# EAGLE design board (EAGLE 9.4.2)
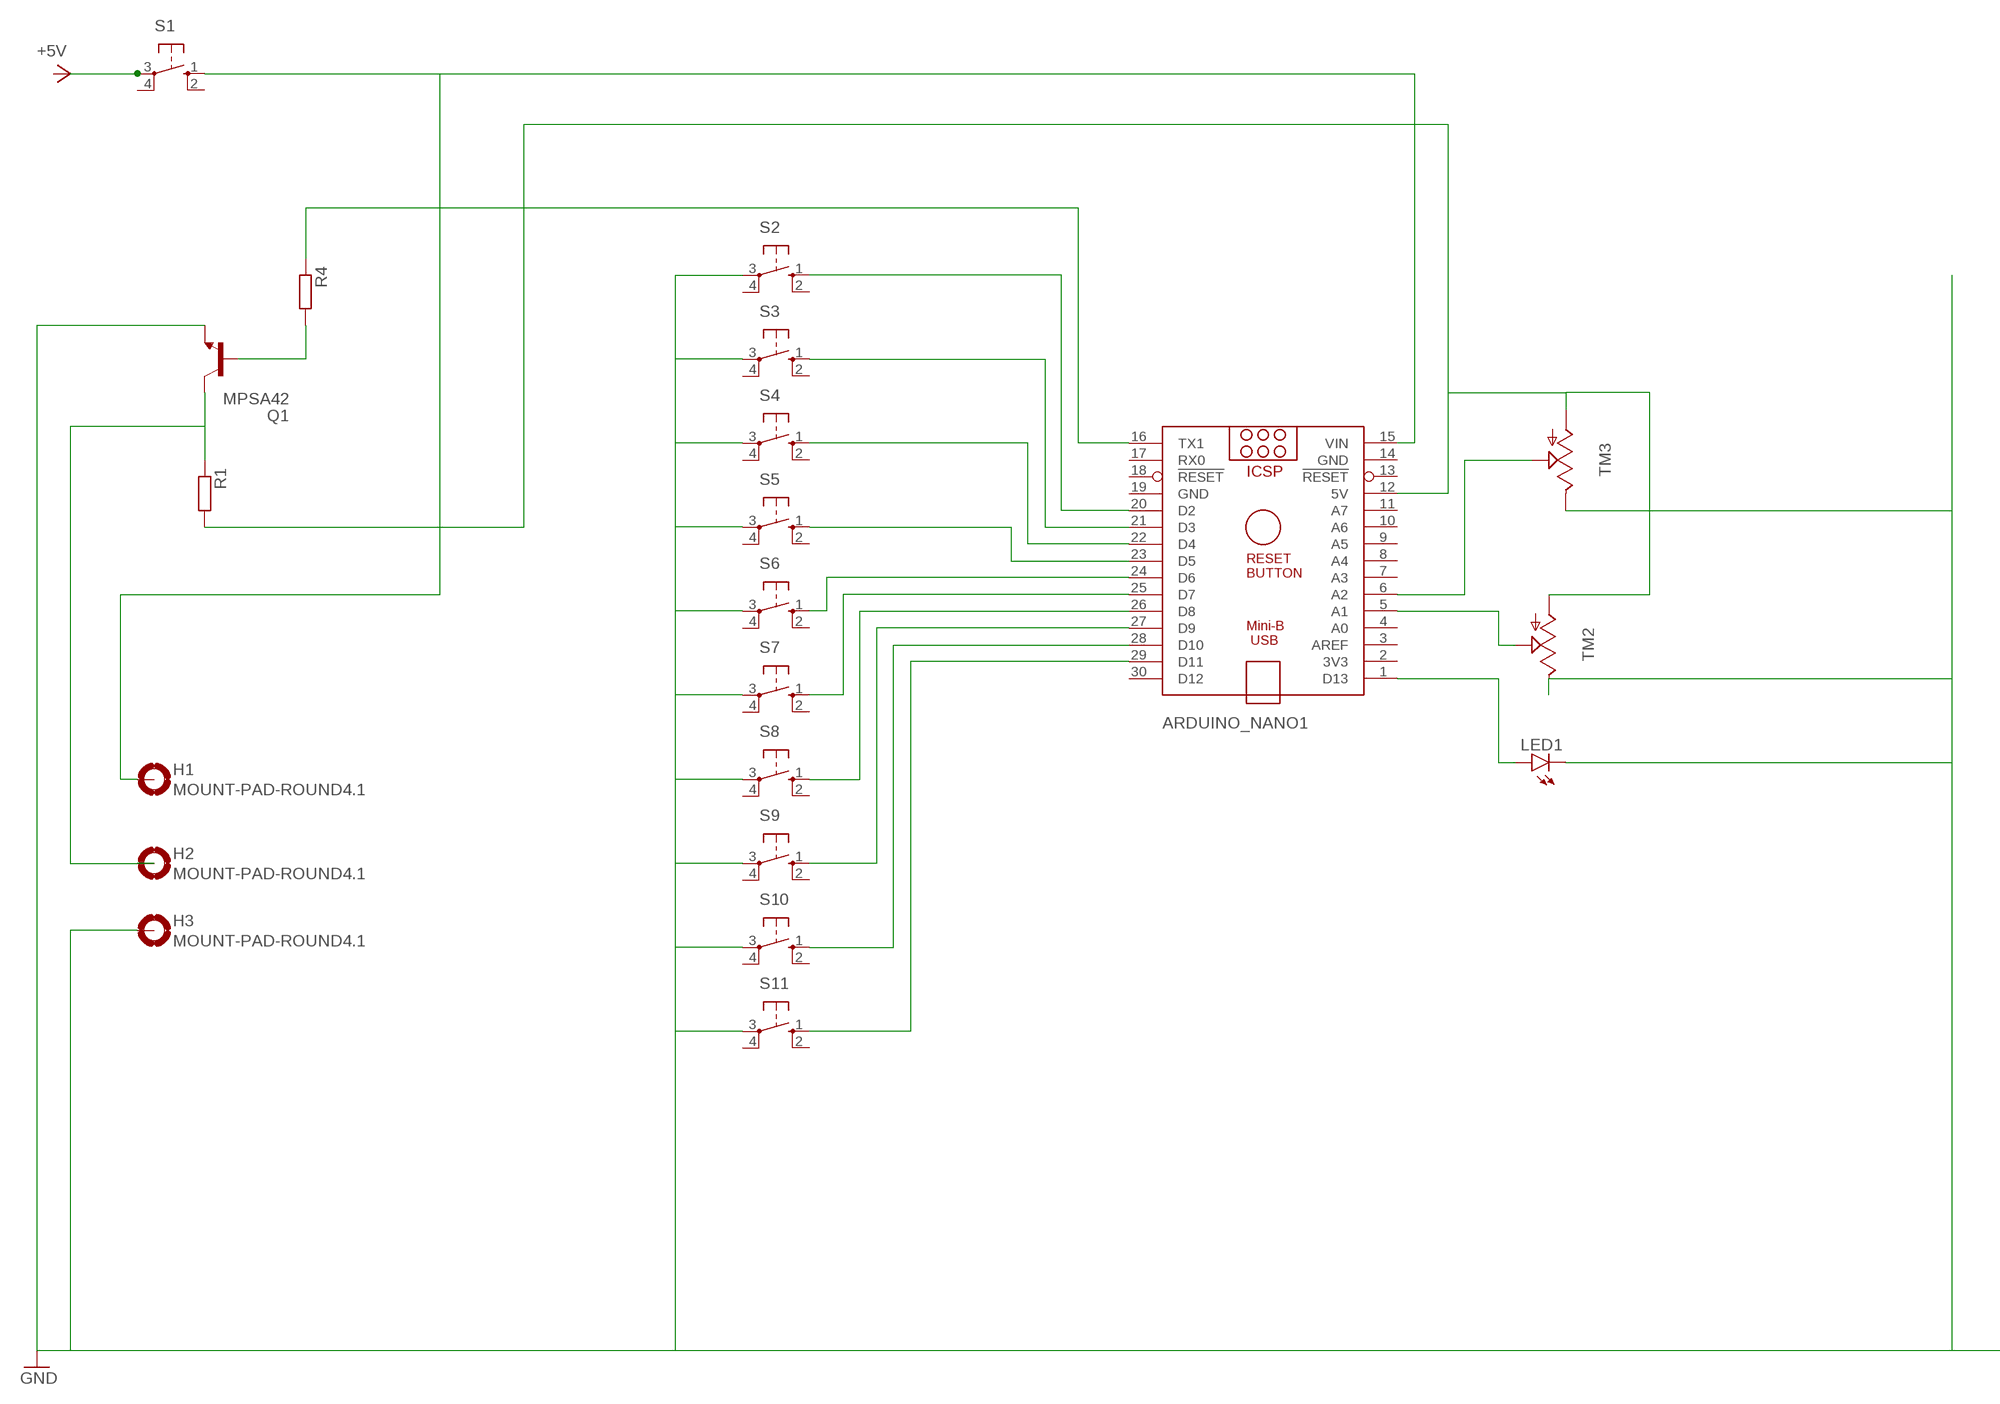
[diagram p0: schematic, sheet 1]

## Parts
ARDUINO_NANO1  ARDUINO_NANO  [ARDUINO_NANO]
H1  MOUNT-PAD-ROUND4.1  [4,1-PAD]
H2  MOUNT-PAD-ROUND4.1  [4,1-PAD]
H3  MOUNT-PAD-ROUND4.1  [4,1-PAD]
LED1  LED5MM  [LED5MM]
Q1  MPSA42  [TO92]
R1  R-EU_0204/2V  [0204V]
R4  R-EU_0204/2V  [0204V]
S1  40-XX  [B3F-40XX]
S2  10-XX  [B3F-10XX]
S3  10-XX  [B3F-10XX]
S4  10-XX  [B3F-10XX]
S5  10-XX  [B3F-10XX]
S6  10-XX  [B3F-10XX]
S7  10-XX  [B3F-10XX]
S8  10-XX  [B3F-10XX]
S9  10-XX  [B3F-10XX]
S10  10-XX  [B3F-10XX]
S11  10-XX  [B3F-10XX]
TM2  TRIMSLIDE75  [SLIDEPOT-75]
TM3  TRIMSLIDE75  [SLIDEPOT-75]

## Nets
GND: H3.B4,1(MOUNT) LED1.K(C) Q1.3(E) S2.3(P) S3.3(P) S4.3(P) S5.3(P) S6.3(P) S7.3(P) S8.3(P) S9.3(P) S10.3(P) S11.3(P) TM2.B TM3.B
N$1: S1.3(P)
N$2: ARDUINO_NANO1.12(5V) R1.2 TM2.A TM3.A
N$3: ARDUINO_NANO1.20(D2) S2.1(S)
N$4: ARDUINO_NANO1.21(D3) S3.1(S)
N$5: ARDUINO_NANO1.22(D4) S4.1(S)
N$6: ARDUINO_NANO1.23(D5) S5.1(S)
N$7: ARDUINO_NANO1.24(D6) S6.1(S)
N$8: ARDUINO_NANO1.25(D7) S7.1(S)
N$9: ARDUINO_NANO1.26(D8) S8.1(S)
N$10: ARDUINO_NANO1.27(D9) S9.1(S)
N$11: ARDUINO_NANO1.28(D10) S10.1(S)
N$12: ARDUINO_NANO1.29(D11) S11.1(S)
N$13: ARDUINO_NANO1.15(VIN) H1.B4,1(MOUNT) S1.1(S)
N$14: ARDUINO_NANO1.16(TX1) R4.1
N$15: Q1.2(B) R4.2
N$16: ARDUINO_NANO1.6(A2) TM3.WIPER
N$17: ARDUINO_NANO1.5(A1) TM2.WIPER
N$18: H2.B4,1(MOUNT) Q1.1(C) R1.1
N$19: ARDUINO_NANO1.1(D13) LED1.A
Unconnected: ARDUINO_NANO1.2(3V3) ARDUINO_NANO1.3(AREF) ARDUINO_NANO1.4(A0) ARDUINO_NANO1.7(A3) ARDUINO_NANO1.8(A4) ARDUINO_NANO1.9(A5) ARDUINO_NANO1.10(A6) ARDUINO_NANO1.11(A7) ARDUINO_NANO1.13(!RESET) ARDUINO_NANO1.17(RX0) ARDUINO_NANO1.18(!RESET) ARDUINO_NANO1.30(D12) S1.2(S1) S1.4(P1) S2.2(S1) S2.4(P1) S3.2(S1) S3.4(P1) S4.2(S1) S4.4(P1) S5.2(S1) S5.4(P1) S6.2(S1) S6.4(P1) S7.2(S1) S7.4(P1) S8.2(S1) S8.4(P1) S9.2(S1) S9.4(P1) S10.2(S1) S10.4(P1) S11.2(S1) S11.4(P1)

## Power pins joined to a net without a drawn wire
GND: ARDUINO_NANO1.14(GND) ARDUINO_NANO1.19(GND)

## Library data of the parts
ARDUINO_NANO1 = ArduinoNanoV30:ARDUINO_NANO: Arduino Nano V3.0 Overview: The Arduino Nano is a small, complete, and breadboard-friendly board based on the ATmega328 (Arduino Nano 3.x) or ATmega168 (Arduino Nano 2.x). It has more or less the same functionality of the Arduino Duemilanove, but in a different package. It lacks only a DC power jack, and works with a Mini-B USB cable instead of a standard one. The Nano was designed and is being produced by Gravitech. Specifications: Microcontroller Atmel ATmega168 or ATmega328 Operating Voltage (logic level) 5 V Input Voltage (recommended) 7-12 V Input Voltage (limits) 6-20 V Digital I/O Pins 14 (of which 6 provide PWM output) Analog Input Pins 8 DC Current per I/O Pin 40 mA Flash Memory 16 KB (ATmega168) or 32 KB (ATmega328) of which 2 KB used by bootloader SRAM 1 KB (ATmega168) or 2 KB (ATmega328) EEPROM 512 bytes (ATmega168) or 1 KB (ATmega328) Clock Speed 16 MHz Dimensions 0.73" x 1.70" Length 45 mm Width 18 mm Weigth 5 g Power: The Arduino Nano can be powered via the Mini-B USB connection, 6-20V unregulated external power supply (pin 30), or 5V regulated external power supply (pin 27). The power source is automatically selected to the highest voltage source. Memory: The ATmega168 has 16 KB of flash memory for storing code (of which 2 KB is used for the bootloader); the ATmega328 has 32 KB, (also with 2 KB used for the bootloader). The ATmega168 has 1 KB of SRAM and 512 bytes of EEPROM (which can be read and written with the EEPROM library); the ATmega328 has 2 KB of SRAM and 1 KB of EEPROM. Input and Output: Each of the 14 digital pins on the Nano can be used as an input or output, using pinMode(), digitalWrite(), and digitalRead() functions. They operate at 5 volts. Each pin can provide or receive a maximum of 40 mA and has an internal pull-up resistor (disconnected by default) of 20-50 kOhms. In addition, some pins have specialized functions. Visit Arduino - ArduinoBoardNano <https://www.arduino.cc/en/Main/ArduinoBoardNano>
H1-H3 = holes:MOUNT-PAD-ROUND: MOUNTING PAD, round
LED1 = led:LED: LED OSRAM: - CHIPLED LG R971, LG N971, LY N971, LG Q971, LY Q971, LO R971, LY R971 LH N974, LH R974 LS Q976, LO Q976, LY Q976 LO Q996 - Hyper CHIPLED LW Q18S LB Q993, LB Q99A, LB R99A - SideLED LS A670, LO A670, LY A670, LG A670, LP A670 LB A673, LV A673, LT A673, LW A673 LH A674 LY A675 LS A676, LA A676, LO A676, LY A676, LW A676 LS A679, LY A679, LG A679 - Hyper Micro SIDELED® LS Y876, LA Y876, LO Y876, LY Y876 LT Y87S - SmartLED LW L88C, LW L88S LB L89C, LB L89S, LG L890 LS L89K, LO L89K, LY L89K LS L896, LA L896, LO L896, LY L896 - TOPLED LS T670, LO T670, LY T670, LG T670, LP T670 LSG T670, LSP T670, LSY T670, LOP T670, LYG T670 LG T671, LOG T671, LSG T671 LB T673, LV T673, LT T673, LW T673 LH T674 LS T676, LA T676, LO T676, LY T676, LB T676, LH T676, LSB T676, LW T676 LB T67C, LV T67C, LT T67C, LS T67K, LO T67K, LY T67K, LW E67C LS E67B, LA E67B, LO E67B, LY E67B, LB E67C, LV E67C, LT E67C LW T67C LS T679, LY T679, LG T679 LS T770, LO T770, LY T770, LG T770, LP T770 LB T773, LV T773, LT T773, LW T773 LH T774 LS E675, LA E675, LY E675, LS T675 LS T776, LA T776, LO T776, LY T776, LB T776 LHGB T686 LT T68C, LB T68C - Hyper Mini TOPLED® LB M676 - Mini TOPLED Santana® LG M470 LS M47K, LO M47K, LY M47K Source: http://www.osram.convergy.de LUXEON: - LUMILED® LXK2-PW12-R00, LXK2-PW12-S00, LXK2-PW14-U00, LXK2-PW14-V00 LXK2-PM12-R00, LXK2-PM12-S00, LXK2-PM14-U00 LXK2-PE12-Q00, LXK2-PE12-R00, LXK2-PE12-S00, LXK2-PE14-T00, LXK2-PE14-U00 LXK2-PB12-K00, LXK2-PB12-L00, LXK2-PB12-M00, LXK2-PB14-N00, LXK2-PB14-P00, LXK2-PB14-Q00 LXK2-PR12-L00, LXK2-PR12-M00, LXK2-PR14-Q00, LXK2-PR14-R00 LXK2-PD12-Q00, LXK2-PD12-R00, LXK2-PD12-S00 LXK2-PH12-R00, LXK2-PH12-S00 LXK2-PL12-P00, LXK2-PL12-Q00, LXK2-PL12-R00 Source: www.luxeon.com KINGBRIGHT: KA-3528ASYC Source: www.kingbright.com
Q1 = MPSA42:MPSA42: NPN TRANSISTOR; AVAILABILITY: Unavailable; DESCRIPTION: TRANSISTOR, NPN, TO-92; Transistor Type: Bipolar; Transistor Polarity: NPN; Collector-to-Emitter Breakdown Voltage: 3...; MF: Central Semiconductor; MP: MPSA42; PACKAGE: TO-92 Multicomp; PRICE: None
R1 R4 = rcl:R-EU_: RESISTOR, European symbol; SPICEPREFIX: R
S1 = switch-omron:40-XX: OMRON SWITCH; MF: OMRON COMPONENTS USA; MPN: B3F-4000; OC_FARNELL: 176434; OC_NEWARK: 36K3105
S2-S11 = switch-omron:10-XX: OMRON SWITCH; MPN: B3F-1000; OC_FARNELL: 176432; OC_NEWARK: 36M3542
TM2 TM3 = Bourns PTA series:TRIM: Sliding potentiometers Based on Adafruits (https://github.com/adafruit/Adafruit-Eagle-Library) 'TRIM' device. For Bourns PTA series and TT Electronics PSxx series potentiometers.

## Board
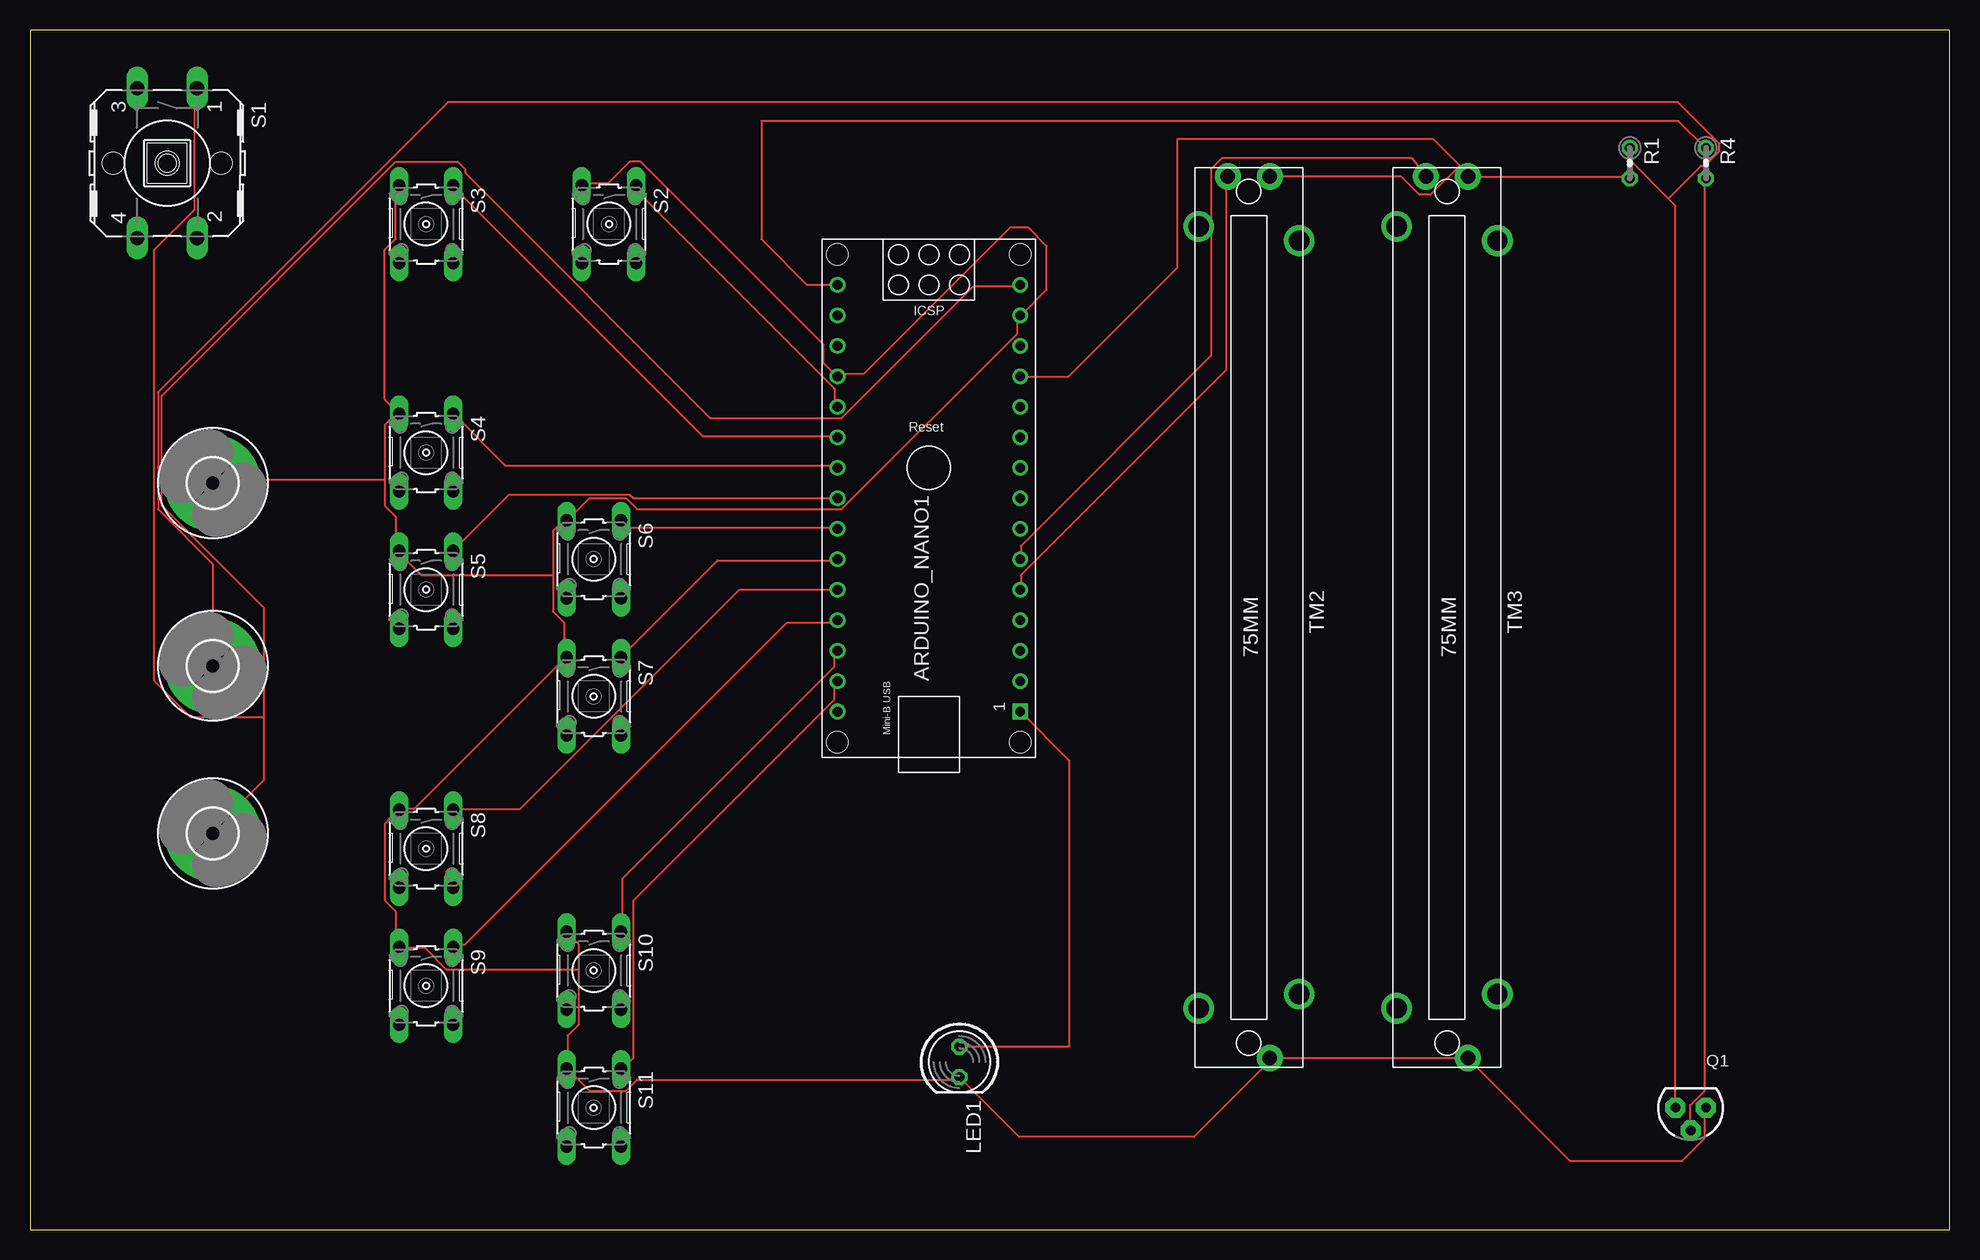
[diagram p1: board, top side]

Size 160 x 100 mm. Coordinates in mm from the lower left corner, seen from the top.
Outline: 0,0 160,0 160,100 0,100 0,0
Copper layers (1*16): Top 0.035mm / dielectric 1.5mm / Bottom 0.035mm
Design rules "default": minimum track width 6mil, minimum drill 0.35mm, track to track 6mil, track to pad 6mil, pad to pad 6mil, via to via 6mil, smd to smd 6mil, copper to edge 40mil, drill to drill 6mil, minimum pad ring 10mil, minimum via ring 8mil, stop-mask expansion 4mil, vias tented up to drill 0mil, thermal gap 10mil

### Footprints (pad centres in the part's own frame; a part is rotated, then mirrored left to right if it is on the bottom)
ARDUINO_NANO = drill 0.8 square: 1 -20.32,-7.62 | drill 0.8: 2 -17.78,-7.62; 3 -15.24,-7.62; 4 -12.7,-7.62; 5 -10.16,-7.62; 6 -7.62,-7.62; 7 -5.08,-7.62; 8 -2.54,-7.62; 9 0,-7.62; 10 2.54,-7.62; 11 5.08,-7.62; 12 7.62,-7.62; 13 10.16,-7.62; 14 12.7,-7.62; 15 15.24,-7.62; 16 15.24,7.62; 17 12.7,7.62; 18 10.16,7.62; 19 7.62,7.62; 20 5.08,7.62; 21 2.54,7.62; 22 0,7.62; 23 -2.54,7.62; 24 -5.08,7.62; 25 -7.62,7.62; 26 -10.16,7.62; 27 -12.7,7.62; 28 -15.24,7.62; 29 -17.78,7.62; 30 -20.32,7.62 | hole 1.778: -22.86,-7.62; -22.86,7.62; 17.78,7.62; 17.78,-7.62
4,1-PAD = drill 4.1 pad 8: B4,1 0,0
LED5MM = drill 0.813 octagon: A -1.27,0; K 1.27,0
TO92 = drill 0.813 pad 1.676 octagon: 1 1.27,0; 2 0,1.905; 3 -1.27,0
0204V = drill 0.813 octagon: 1 -1.27,0; 2 1.27,0
B3F-40XX = drill 1.194 long: 1 -6.248,2.489; 2 6.248,2.489; 3 -6.248,-2.489; 4 6.248,-2.489 | hole 1.803: 0,-4.496; 0,4.496
B3F-10XX = drill 1.016 long: 1 -3.251,2.261; 2 3.251,2.261; 3 -3.251,-2.261; 4 3.251,-2.261
SLIDEPOT-75 = drill 1.2 pad 2.184: A -36.99,1.75; B 36.514,1.75; WIPER -36.99,-1.75 | drill 1.7 pad 2.54: P$1 -31.64,4.2; P$2 31.164,4.2; P$3 -32.84,-4.2; P$4 32.364,-4.2

### Placement (x,y rotation side)
ARDUINO_NANO1  74.93,63.5 90 top
H1  15.24,33.02 270 top
H2  15.24,46.99 270 top
H3  15.24,62.23 270 top
LED1  77.47,13.97 270 top
Q1  138.43,10.16 180 top
R1  133.35,88.9 270 top
R4  139.7,88.9 270 top
S1  11.43,88.9 270 top
S2  48.26,83.82 270 top
S3  33.02,83.82 270 top
S4  33.02,64.77 270 top
S5  33.02,53.34 270 top
S6  46.99,55.88 270 top
S7  46.99,44.45 270 top
S8  33.02,31.75 270 top
S9  33.02,20.32 270 top
S10  46.99,21.59 270 top
S11  46.99,10.16 270 top
TM2  101.6,50.8 270 top
TM3  118.11,50.8 270 top

### Tracks (layer width: path | path; a pad name or v marks a point on that pad's centre or on a via)
GND
  Top 0.152: Q1.3 139.6,10.06 139.6,7.62 137.72,5.74 128.37,5.74 120.09,14.02 TM3.B 119.79,14.33 103.63,14.33 TM2.B 103.33,14.02 97.03,7.72 82.45,7.72 LED1.K 77.42,12.5 50.6,12.5 49.68,11.58 46.63,11.58 44.81,13.41 | S2.3 46.02,87.17 48.16,87.17 49.99,89 50.9,89 66.14,73.76 66.14,72.24 67.06,71.32 ARDUINO_NANO1.19 67.36,71.32 69.49,71.32 81.69,83.52 83.21,83.52 84.73,81.99 84.73,78.33 82.6,76.2 ARDUINO_NANO1.14 82.3,76.2 82.3,74.68 67.67,60.05 50.6,60.05 49.68,60.96 46.63,60.96 44.81,59.13 S6.3 44.5,59.13 43.59,58.22 43.59,54.56 | 44.81,13.41 44.81,16.15 45.72,17.07 45.72,21.64 | 45.72,21.64 45.72,23.77 44.81,24.69 S10.3 | 45.72,21.64 34.75,21.64 32.92,23.47 30.79,23.47 S9.3 30.48,23.77 30.48,26.52 29.57,27.43 29.57,33.83 30.48,34.75 S8.3 30.79,35.05 32,35.05 44.5,47.55 S7.3 44.5,47.85 44.5,50.6 43.59,51.51 43.59,54.56 | 29.57,62.48 29.57,67.06 30.48,67.97 S4.3 30.48,68.28 29.57,69.19 29.57,81.69 30.48,82.6 30.48,86.87 S3.3 | 29.57,62.48 29.57,60.35 30.48,59.44 30.48,56.69 S5.3 30.79,56.39 32.61,54.56 43.59,54.56 | 29.57,62.48 15.24,62.48 H3.B4,1 | 44.81,13.41 S11.3
N$2
  Top 0.152: ARDUINO_NANO1.12 86.56,71.12 95.61,80.16 95.61,90.88 116.99,90.88 119.18,88.7 | 119.18,88.7 119.79,88.09 TM3.A 120.09,87.78 133.2,87.78 R1.2 | 119.18,88.7 116.74,86.26 115.82,86.26 114.3,87.78 103.63,87.78 TM2.A
N$3
  Top 0.152: ARDUINO_NANO1.20 67.06,68.58 67.06,70.1 50.29,86.87 S2.1
N$4
  Top 0.152: ARDUINO_NANO1.21 67.06,66.14 56.08,66.14 35.36,86.87 S3.1
N$5
  Top 0.152: ARDUINO_NANO1.22 67.06,63.7 39.62,63.7 35.36,67.97 S4.1
N$6
  Top 0.152: ARDUINO_NANO1.23 50.29,60.96 49.99,61.27 39.93,61.27 35.36,56.69 S5.1
N$7
  Top 0.152: ARDUINO_NANO1.24 67.06,58.52 49.99,58.52 49.38,59.13 S6.1
N$8
  Top 0.152: ARDUINO_NANO1.25 67.06,55.78 57.3,55.78 49.38,47.85 S7.1
N$9
  Top 0.152: ARDUINO_NANO1.26 59.13,53.34 40.84,35.05 35.36,35.05 S8.1
N$10
  Top 0.152: ARDUINO_NANO1.27 67.06,50.6 63.09,50.6 36.27,23.77 35.36,23.77 S9.1
N$11
  Top 0.152: ARDUINO_NANO1.28 67.06,48.16 67.06,46.94 49.38,29.26 49.38,24.99 S10.1
N$12
  Top 0.152: ARDUINO_NANO1.29 67.06,45.72 67.06,44.2 50.29,27.43 50.29,14.33 49.38,13.41 S11.1
N$13
  Top 0.152: 19.51,42.67 19.51,37.49 15.24,33.22 H1.B4,1 | 19.51,42.67 19.51,51.82 10.97,60.35 10.97,69.49 30.48,89 35.66,89 36.27,88.39 36.27,88.09 56.69,67.67 67.67,67.67 78.64,78.64 82.3,78.64 ARDUINO_NANO1.15 | 19.51,42.67 13.41,42.67 10.36,45.72 10.36,81.69 13.72,85.04 13.72,95.1 S1.1
N$14
  Top 0.152: ARDUINO_NANO1.16 64.77,78.74 60.96,82.55 60.96,92.41 137.41,92.41 139.6,90.22 R4.1
N$15
  Top 0.152: R4.2 139.6,87.48 139.6,11.58 138.38,10.36 138.38,8.53 Q1.2
N$16
  Top 0.152: ARDUINO_NANO1.6 82.6,56.08 82.6,57 98.45,72.85 98.45,88.39 99.36,89.31 115.18,89.31 TM3.WIPER
N$17
  Top 0.152: ARDUINO_NANO1.5 82.6,53.34 82.6,54.56 99.67,71.63 99.67,87.78 TM2.WIPER
N$18
  Top 0.152: 136.55,85.95 137.16,85.34 Q1.1 | 136.55,85.95 133.5,89 133.5,89.92 R1.1 | H2.B4,1 15.24,55.47 10.67,60.05 10.67,69.8 34.85,93.98 137.36,93.98 140.82,90.53 140.82,89.92 139.6,88.7 139.29,88.7 136.55,85.95
N$19
  Top 0.152: ARDUINO_NANO1.1 86.61,39.12 86.61,15.24 LED1.A